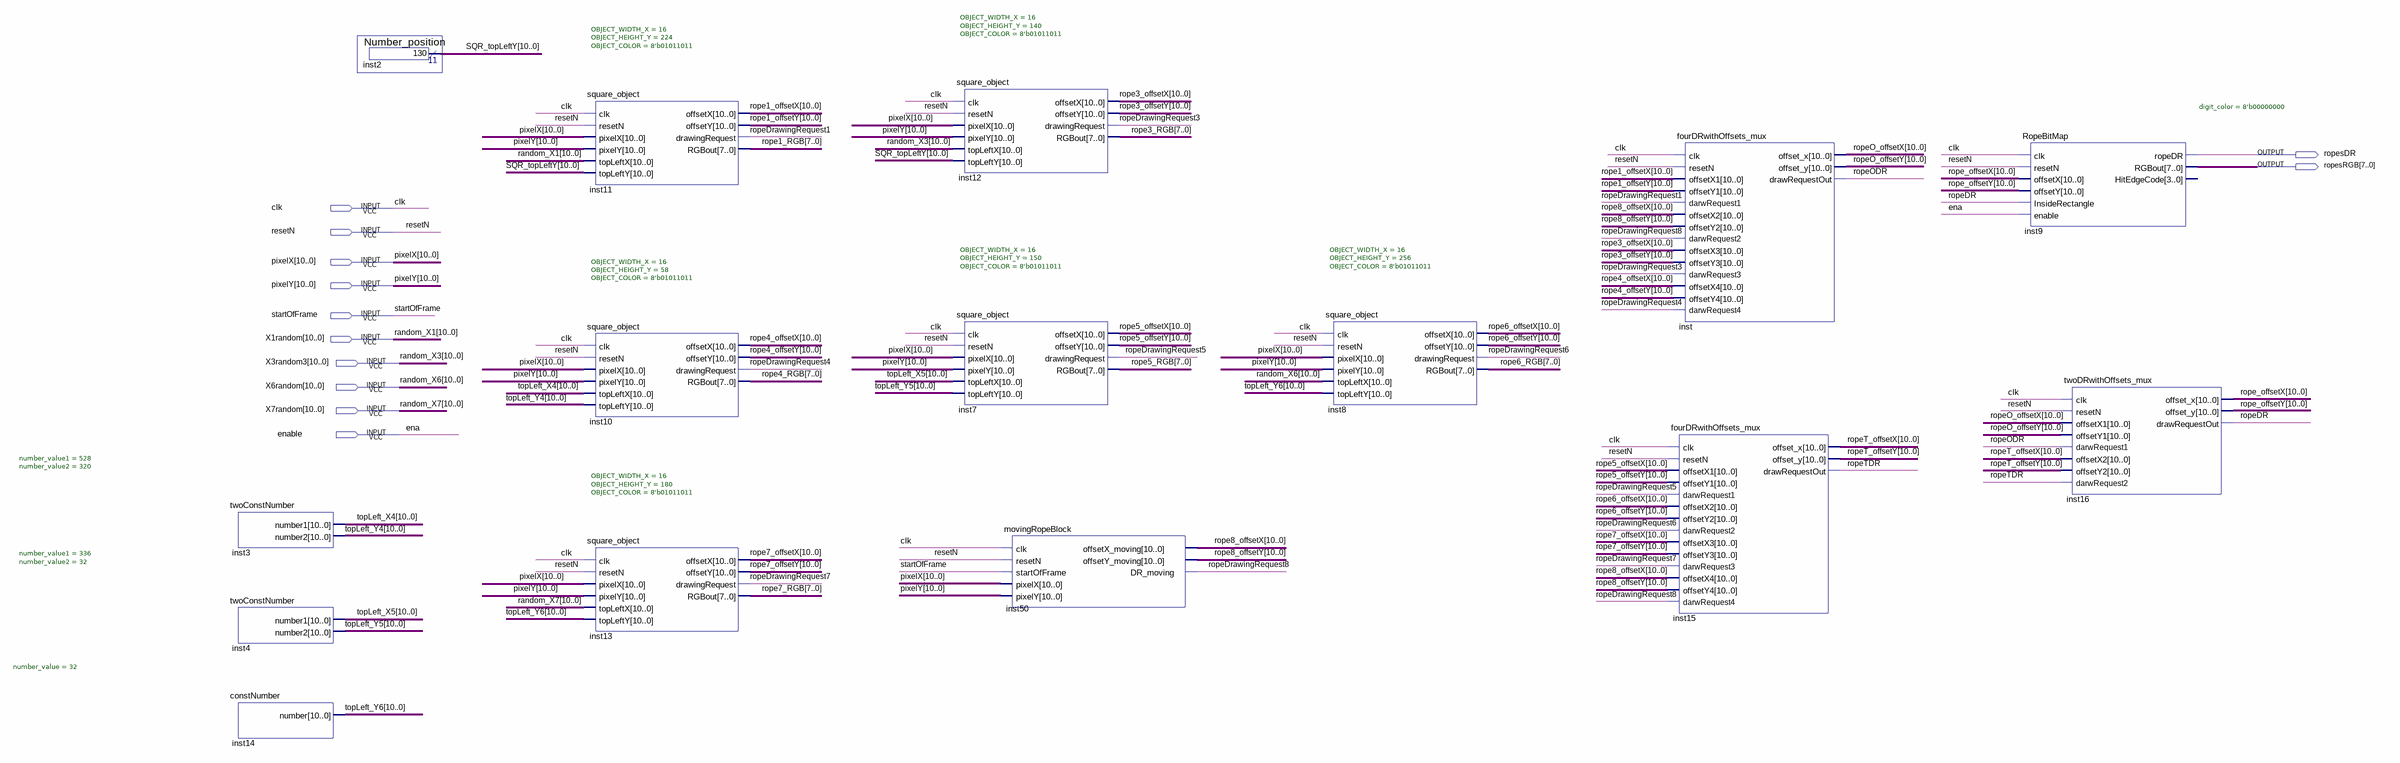
[diagram p0: schematic sheet]
// Quartus schematic ropesBlock.bdf as structural Verilog: 15 symbols, 12 pins
module ropesBlock (
  input  clk,
  input  resetN,
  input  [10:0] pixelX,
  input  [10:0] pixelY,
  input  startOfFrame,
  input  [10:0] X1random,
  input  [10:0] X3random3,
  input  [10:0] X6random,
  input  [10:0] X7random,
  input  enable,
  output ropesDR,
  output [7:0] ropesRGB
);

  wire ropeDR, ropeDrawingRequest1, ropeDrawingRequest3, ropeDrawingRequest4, ropeDrawingRequest5,
       ropeDrawingRequest6, ropeDrawingRequest7, ropeDrawingRequest8, ropeODR, ropeTDR;
  wire [7:0] rope1_RGB, rope3_RGB, rope4_RGB, rope5_RGB, rope6_RGB, rope7_RGB;
  wire [10:0] rope1_offsetX, rope1_offsetY, rope3_offsetX, rope3_offsetY, rope4_offsetX, rope4_offsetY,
       rope5_offsetX, rope5_offsetY, rope6_offsetX, rope6_offsetY, rope7_offsetX, rope7_offsetY,
       rope8_offsetX, rope8_offsetY, rope_offsetX, rope_offsetY, ropeO_offsetX, ropeO_offsetY, ropeT_offsetX,
       ropeT_offsetY, SQR_topLeftY, topLeft_X4, topLeft_X5, topLeft_Y4, topLeft_Y5, topLeft_Y6;

  twoConstNumber #(.number_value1(528), .number_value2(320)) inst3 (.number1(topLeft_X4), .number2(topLeft_Y4));
  twoConstNumber #(.number_value1(336), .number_value2(32)) inst4 (.number1(topLeft_X5), .number2(topLeft_Y5));
  constNumber #(.number_value(32)) inst14 (.number(topLeft_Y6));
  Number_position inst2 (.result(SQR_topLeftY));
  square_object #(.OBJECT_WIDTH_X(16), .OBJECT_HEIGHT_Y(224), .OBJECT_COLOR(8'b01011011)) inst11 (
    .clk(clk), .resetN(resetN), .pixelX(pixelX), .pixelY(pixelY), .topLeftX(X1random),
    .topLeftY(SQR_topLeftY), .offsetX(rope1_offsetX), .offsetY(rope1_offsetY),
    .drawingRequest(ropeDrawingRequest1), .RGBout(rope1_RGB));
  square_object #(.OBJECT_WIDTH_X(16), .OBJECT_HEIGHT_Y(58), .OBJECT_COLOR(8'b01011011)) inst10 (
    .clk(clk), .resetN(resetN), .pixelX(pixelX), .pixelY(pixelY), .topLeftX(topLeft_X4),
    .topLeftY(topLeft_Y4), .offsetX(rope4_offsetX), .offsetY(rope4_offsetY),
    .drawingRequest(ropeDrawingRequest4), .RGBout(rope4_RGB));
  square_object #(.OBJECT_WIDTH_X(16), .OBJECT_HEIGHT_Y(180), .OBJECT_COLOR(8'b01011011)) inst13 (
    .clk(clk), .resetN(resetN), .pixelX(pixelX), .pixelY(pixelY), .topLeftX(X7random), .topLeftY(topLeft_Y6),
    .offsetX(rope7_offsetX), .offsetY(rope7_offsetY), .drawingRequest(ropeDrawingRequest7), .RGBout(rope7_RGB));
  square_object #(.OBJECT_WIDTH_X(16), .OBJECT_HEIGHT_Y(140), .OBJECT_COLOR(8'b01011011)) inst12 (
    .clk(clk), .resetN(resetN), .pixelX(pixelX), .pixelY(pixelY), .topLeftX(X3random3),
    .topLeftY(SQR_topLeftY), .offsetX(rope3_offsetX), .offsetY(rope3_offsetY),
    .drawingRequest(ropeDrawingRequest3), .RGBout(rope3_RGB));
  square_object #(.OBJECT_WIDTH_X(16), .OBJECT_HEIGHT_Y(150), .OBJECT_COLOR(8'b01011011)) inst7 (
    .clk(clk), .resetN(resetN), .pixelX(pixelX), .pixelY(pixelY), .topLeftX(topLeft_X5),
    .topLeftY(topLeft_Y5), .offsetX(rope5_offsetX), .offsetY(rope5_offsetY),
    .drawingRequest(ropeDrawingRequest5), .RGBout(rope5_RGB));
  movingRopeBlock inst50 (
    .clk(clk), .resetN(resetN), .startOfFrame(startOfFrame), .pixelX(pixelX), .pixelY(pixelY),
    .offsetX_moving(rope8_offsetX), .offsetY_moving(rope8_offsetY), .DR_moving(ropeDrawingRequest8));
  square_object #(.OBJECT_WIDTH_X(16), .OBJECT_HEIGHT_Y(256), .OBJECT_COLOR(8'b01011011)) inst8 (
    .clk(clk), .resetN(resetN), .pixelX(pixelX), .pixelY(pixelY), .topLeftX(X6random), .topLeftY(topLeft_Y6),
    .offsetX(rope6_offsetX), .offsetY(rope6_offsetY), .drawingRequest(ropeDrawingRequest6), .RGBout(rope6_RGB));
  fourDRwithOffsets_mux inst (
    .clk(clk), .resetN(resetN), .offsetX1(rope1_offsetX), .offsetY1(rope1_offsetY),
    .darwRequest1(ropeDrawingRequest1), .offsetX2(rope8_offsetX), .offsetY2(rope8_offsetY),
    .darwRequest2(ropeDrawingRequest8), .offsetX3(rope3_offsetX), .offsetY3(rope3_offsetY),
    .darwRequest3(ropeDrawingRequest3), .offsetX4(rope4_offsetX), .offsetY4(rope4_offsetY),
    .darwRequest4(ropeDrawingRequest4), .offset_x(ropeO_offsetX), .offset_y(ropeO_offsetY),
    .drawRequestOut(ropeODR));
  fourDRwithOffsets_mux inst15 (
    .clk(clk), .resetN(resetN), .offsetX1(rope5_offsetX), .offsetY1(rope5_offsetY),
    .darwRequest1(ropeDrawingRequest5), .offsetX2(rope6_offsetX), .offsetY2(rope6_offsetY),
    .darwRequest2(ropeDrawingRequest6), .offsetX3(rope7_offsetX), .offsetY3(rope7_offsetY),
    .darwRequest3(ropeDrawingRequest7), .offsetX4(rope8_offsetX), .offsetY4(rope8_offsetY),
    .darwRequest4(ropeDrawingRequest8), .offset_x(ropeT_offsetX), .offset_y(ropeT_offsetY),
    .drawRequestOut(ropeTDR));
  RopeBitMap #(.digit_color(8'b00000000)) inst9 (
    .clk(clk), .resetN(resetN), .offsetX(rope_offsetX), .offsetY(rope_offsetY), .InsideRectangle(ropeDR),
    .enable(enable), .ropeDR(ropesDR), .RGBout(ropesRGB));  // open: HitEdgeCode
  twoDRwithOffsets_mux inst16 (
    .clk(clk), .resetN(resetN), .offsetX1(ropeO_offsetX), .offsetY1(ropeO_offsetY), .darwRequest1(ropeODR),
    .offsetX2(ropeT_offsetX), .offsetY2(ropeT_offsetY), .darwRequest2(ropeTDR), .offset_x(rope_offsetX),
    .offset_y(rope_offsetY), .drawRequestOut(ropeDR));

  // Other names for the same wires on the sheet: ena = enable; random_X1[10:0] = X1random;
  //   random_X3[10:0] = X3random3; random_X6[10:0] = X6random; random_X7[10:0] = X7random
endmodule
